# Altium project MP3_Bluetooth_AudioPlayer.PrjPcb
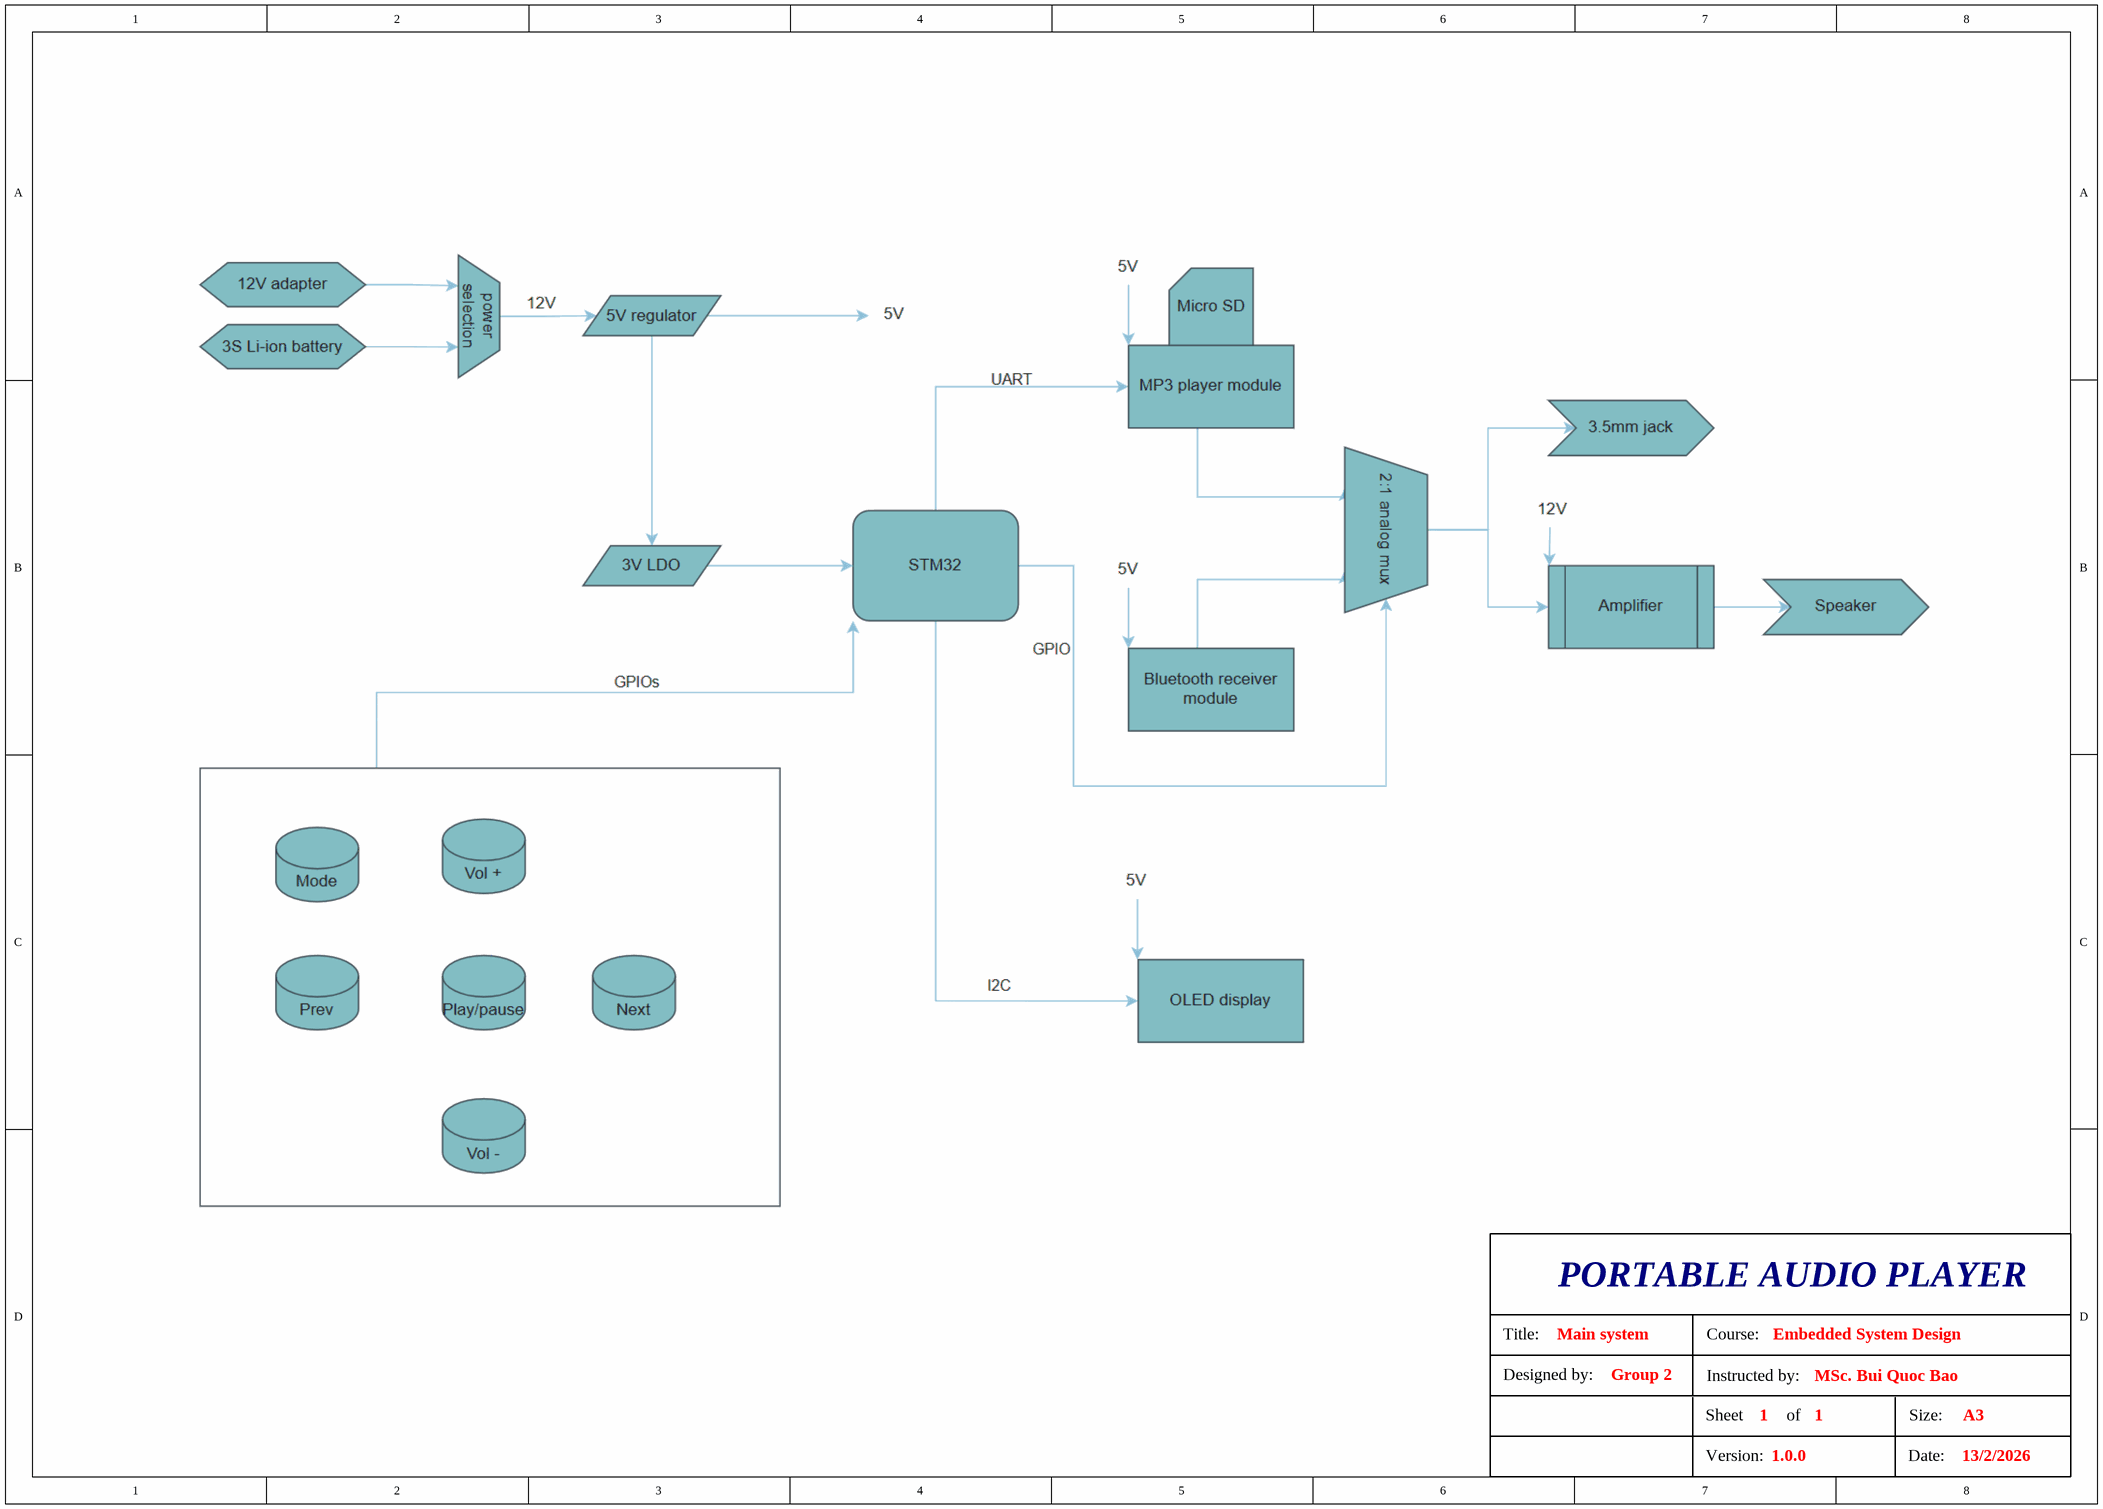
[diagram p0: Sheet3.SchDoc]
3 sheets, 101 parts. Net scope: global (net labels, ports and power ports of the same name join across sheets).
Board file: PCB1.PcbDoc
Sheets:
  Sheet3.SchDoc
  Sheet4.SchDoc
  Sheet1.SchDoc

## Sheet Sheet3.SchDoc
size A3; SheetNumber: 3; SheetTotal: 4

### Notes on the sheet
- PORTABLE AUDIO PLAYER
- Designed by:
- Title:
- Main system
- Group 2
- Instructed by:
- Course:
- Embedded System Design
- MSc. Bui Quoc Bao
- Version:
- Sheet
- 1
- 1.0.0
- of
- Date:
- Size:
- 13/2/2026
- A3

## Sheet Sheet4.SchDoc
size A3; SheetNumber: 4; SheetTotal: 4
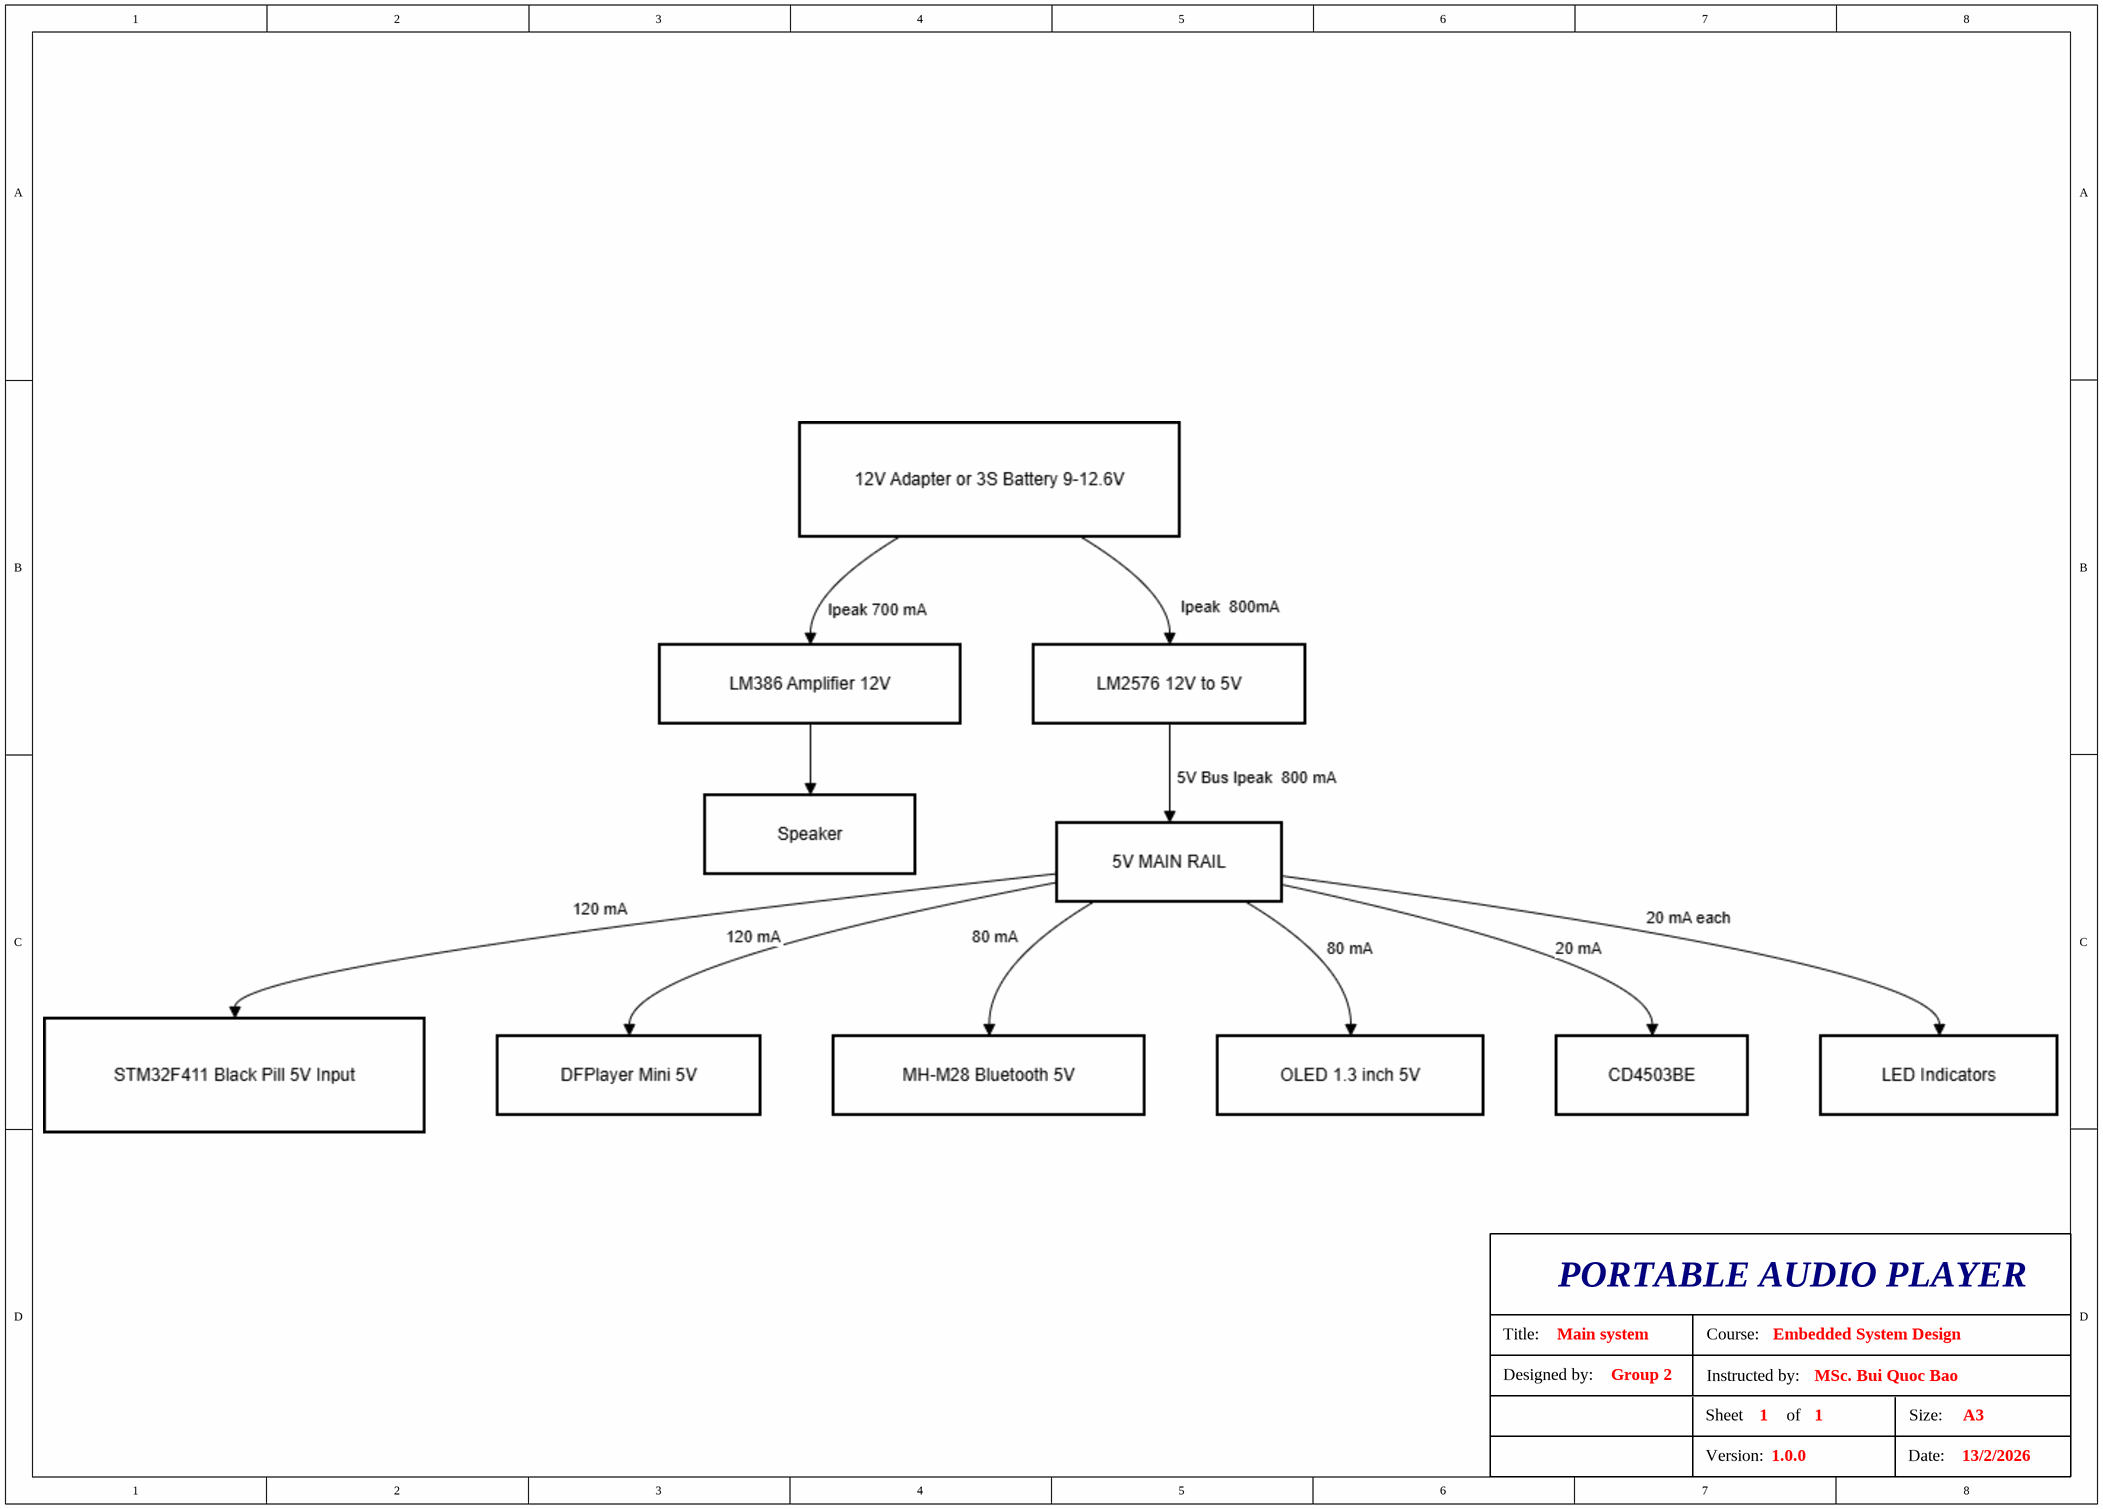
[diagram p1: Sheet4.SchDoc]

### Notes on the sheet
- PORTABLE AUDIO PLAYER
- Designed by:
- Title:
- Main system
- Group 2
- Instructed by:
- Course:
- Embedded System Design
- MSc. Bui Quoc Bao
- Version:
- Sheet
- 1
- 1.0.0
- of
- Date:
- Size:
- 13/2/2026
- A3

## Sheet Sheet1.SchDoc
size A3; SheetNumber: 4; SheetTotal: 4
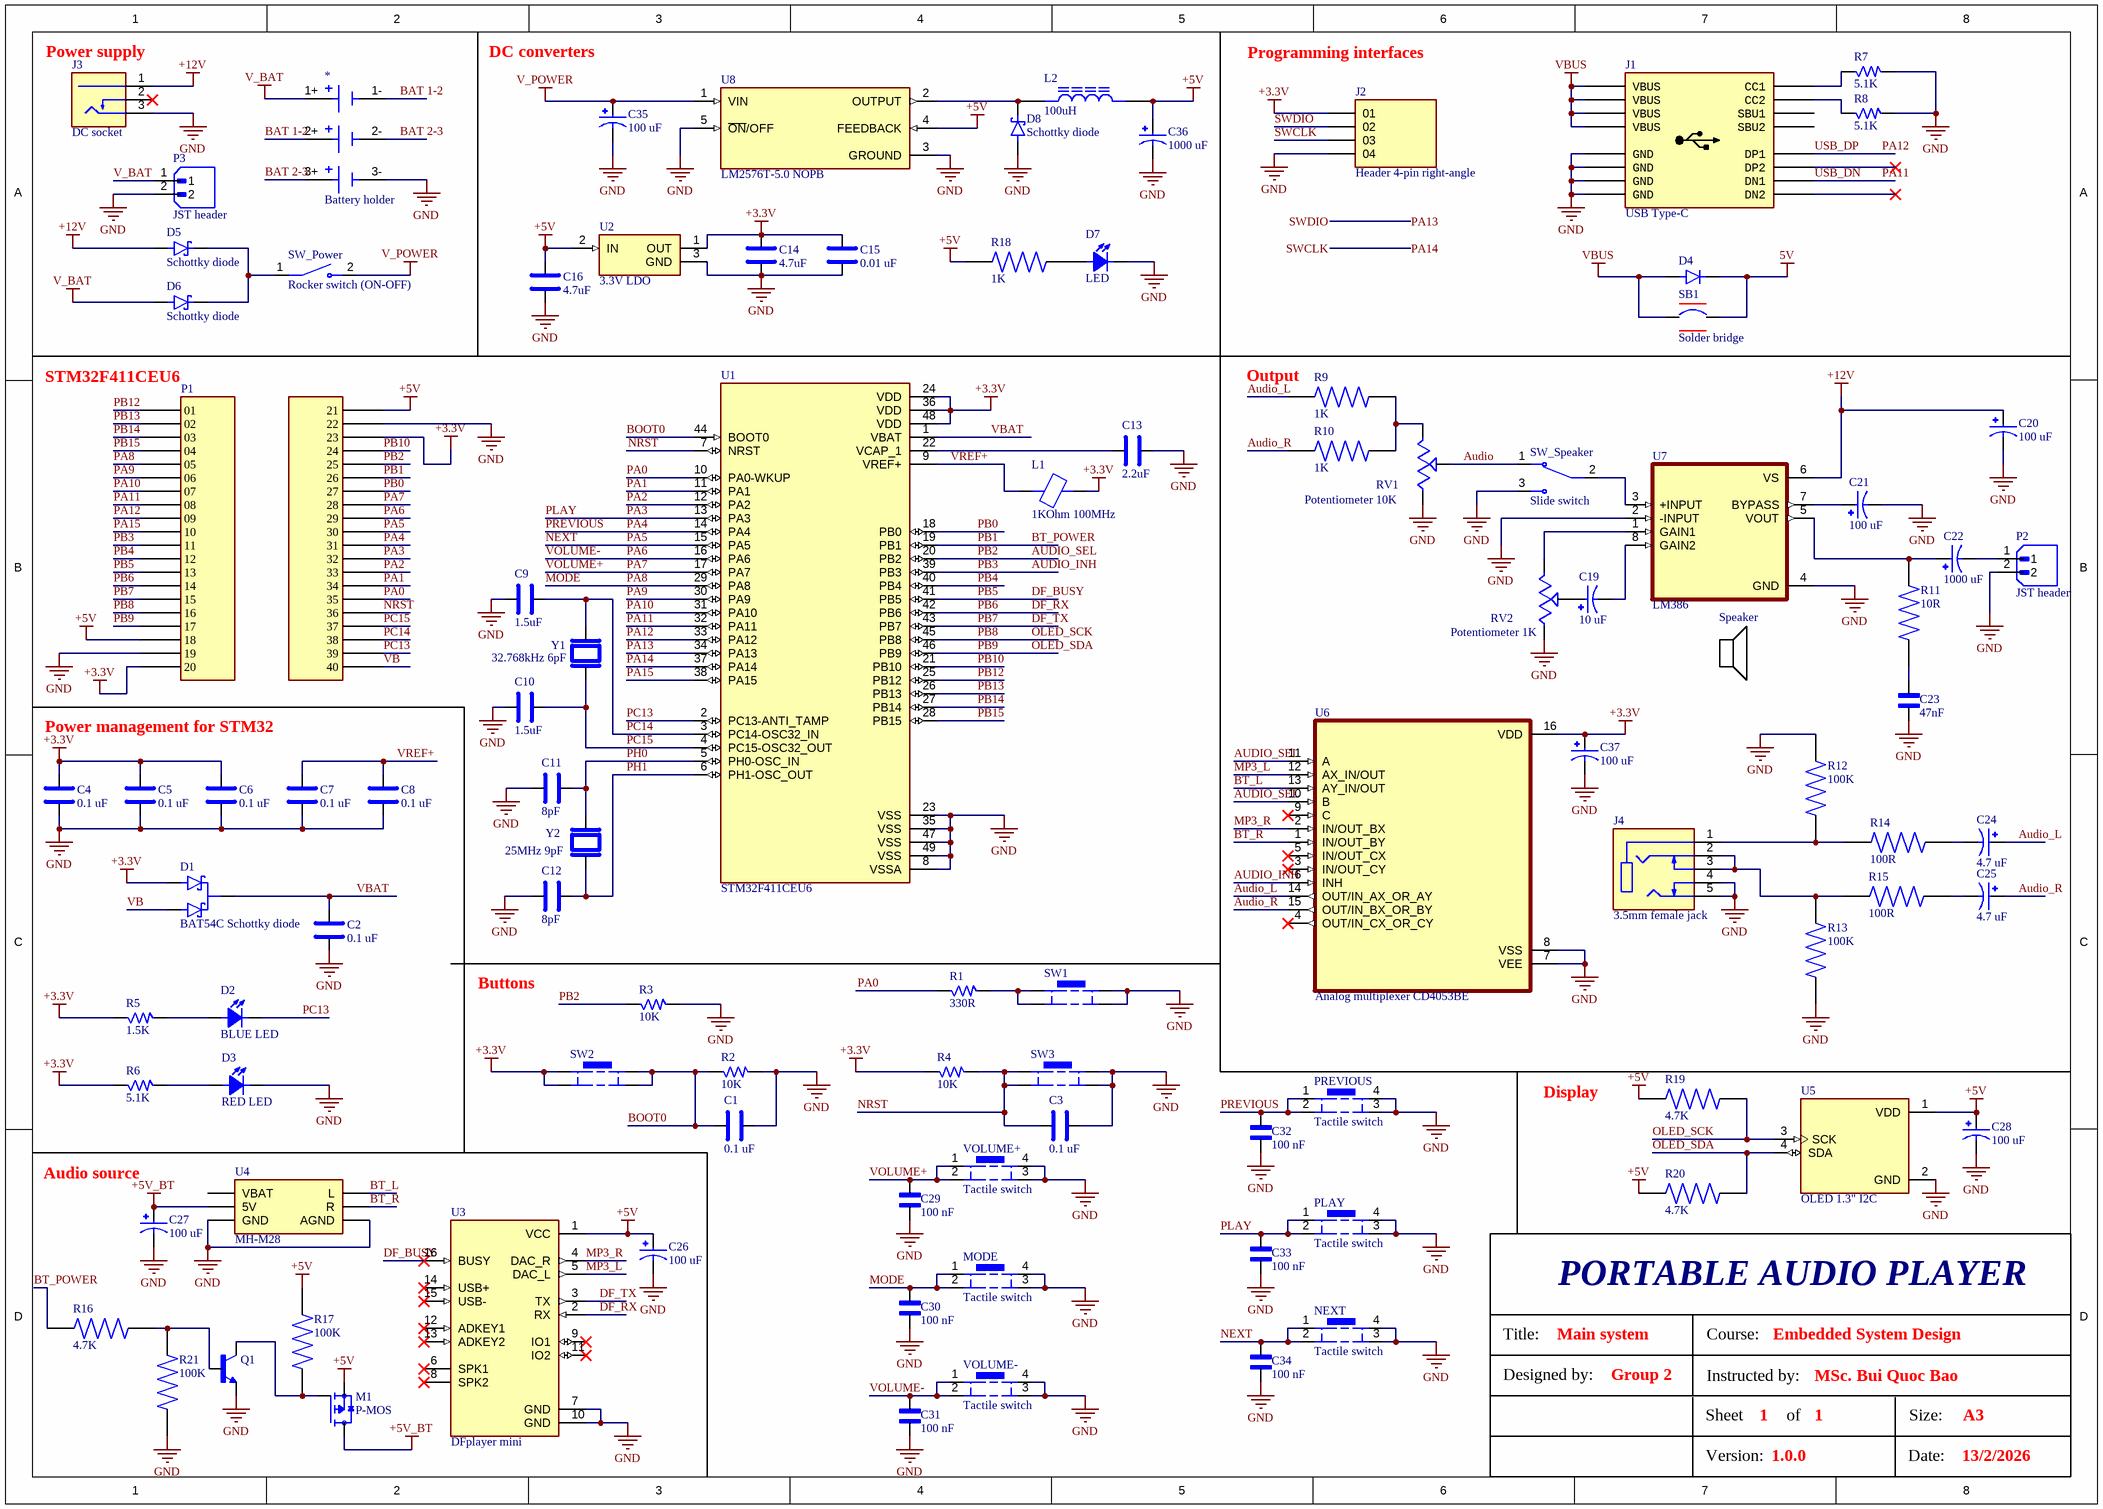
[diagram p2: Sheet1.SchDoc]

### Parts
*  Battery holder  [BAT_BK-18650-PC6]
C1  0.1 uF  [CAP-CER-0603]
C2  0.1 uF  [CAP-CER-0603]
C3  0.1 uF  [CAP-CER-0603]
C4  0.1 uF  [CAP-CER-0603]
C5  0.1 uF  [CAP-CER-0603]
C6  0.1 uF  [CAP-CER-0603]
C7  0.1 uF  [CAP-CER-0603]
C8  0.1 uF  [CAP-CER-0603]
C9  1.5uF  [CAP-CER-0603]
C10  1.5uF  [CAP-CER-0603]
C11  8pF  [CAP-CER-0603]
C12  8pF  [CAP-CER-0603]
C13  2.2uF  [CAP-CER-0603]
C14  4.7uF  [CAP-CER-0603]
C15  0.01 uF  [CAP-CER-0603]
C16  4.7uF  [CAP-CER-0603]
C19  10 uF  [CAPPRD200W50D500H1100]
C20  100 uF  [CAPPRD250W50D630H1120]
C21  100 uF  [CAPPRD250W50D630H1120]
C22  1000 uF  [CAPPRD500W60D1000H2500]
C23  47nF  [CAPRR254W50L508T317H508]
C24  4.7 uF  [CAPPRD200W50D500H1100]
C25  4.7 uF  [CAPPRD200W50D500H1100]
C26  100 uF  [CAPPRD250W50D630H1120]
C27  100 uF  [CAPPRD250W50D630H1120]
C28  100 uF  [CAPPRD250W50D630H1120]
C29  100 nF  [CAPRR254W54L381T254H466]
C30  100 nF  [CAPRR254W54L381T254H466]
C31  100 nF  [CAPRR254W54L381T254H466]
C32  100 nF  [CAPRR254W54L381T254H466]
C33  100 nF  [CAPRR254W54L381T254H466]
C34  100 nF  [CAPRR254W54L381T254H466]
C35  100 uF  [CAPPRD250W50D630H1120]
C36  1000 uF  [CAPPRD500W60D1000H2500]
C37  100 uF  [CAPPRD250W50D630H1120]
D1  BAT54C Schottky diode  [SOT95P237X112-3N]
D2  BLUE LED  [LED-SMD-0603]
D3  RED LED  [LED-SMD-0603]
D4  Diode  [DIOM5227X270N]  (value not drawn)
D5  Schottky diode  [DIOAD1039W78L463D236]
D6  Schottky diode  [DIOAD1039W78L463D236]
D7  LED  [LED-TH-2.54mm]
D8  Schottky diode  [DIOAD1039W78L463D236]
J1  USB Type-C  [TYPE-C-16POS]
J2  Header 4-pin right-angle  [SAMTEC_HTSW-104-08-G-S-RA]
J3  DC socket  [GRAVITECH_CON-SOCJ-2155]
J4  3.5mm female jack  [CLIFF_FC68133]
L1  1KOhm 100MHz  [FERRITE-0603]
L2  100uH  [IND_RLB9012-101KL]
M1  P-MOS  [TO254P1067X483X2286-3]
MODE  Tactile switch  [Tactice-Switch-TH-12x12]
NEXT  Tactile switch  [Tactice-Switch-TH-12x12]
P1  2x20 female header for mounting Blackpill board  [Blackpill board mounting headers]  (value not drawn)
P2  JST header  [JST_B2B-XH-A]
P3  JST header  [JST_B2B-XH-A]
PLAY  Tactile switch  [Tactice-Switch-TH-12x12]
PREVIOUS  Tactile switch  [Tactice-Switch-TH-12x12]
Q1  NPN transistor  [TO92127P495H495-3]  (value not drawn)
R1  330R  [RES-SMD-0603]
R2  10K  [RES-SMD-0603]
R3  10K  [RES-SMD-0603]
R4  10K  [RES-SMD-0603]
R5  1.5K  [RES-SMD-0603]
R6  5.1K  [RES-SMD-0603]
R7  5.1K  [RES-SMD-0603]
R8  5.1K  [RES-SMD-0603]
R9  1K  [RESAD1100W55L680D260]
R10  1K  [RESAD1100W55L680D260]
R11  10R  [RESAD1100W55L680D260]
R12  100K  [RESAD1100W55L680D260]
R13  100K  [RESAD1100W55L680D260]
R14  100R  [RESAD1100W55L680D260]
R15  100R  [RESAD1100W55L680D260]
R16  4.7K  [RESAD1100W55L680D260]
R17  100K  [RESAD1100W55L680D260]
R18  1K  [RESAD1100W55L680D260]
R19  4.7K  [RESAD1100W55L680D260]
R20  4.7K  [RESAD1100W55L680D260]
R21  100K  [RESAD1100W55L680D260]
RV1  Potentiometer 10K  [TRIM_WH148-1A-2-18T-L20]
RV2  Potentiometer 1K  [TRIM_WH148-1A-2-18T-L20]
SB1  Solder bridge  [SOLDER_BRIDGE]
Speaker  Speaker  [50mm speaker]  (value not drawn)
SW1  SW_small_rectangular  [SW_SKRPACE010]  (value not drawn)
SW2  SW_small_rectangular  [SW_SKRPACE010]  (value not drawn)
SW3  SW_small_rectangular  [SW_SKRPACE010]  (value not drawn)
SW_Power  Rocker switch (ON-OFF)  [Rocker switch (ON-OFF)]
SW_Speaker  Slide switch  [SW_SLW-1276864-4A-D]
U1  STM32F411CEU6  [QFN50P700X700X60-49N]
U2  3.3V LDO  [SOT23-3]
U3  DFplayer mini  [MODULE_DFR0299]
U4  MH-M28  [MH-M28]
U5  OLED 1.3" I2C  [LCD_OLED_128X64_1.3_I2C]
U6  Analog multiplexer CD4053BE  [DIP_16]
U7  LM386  [DIP_8]
U8  LM2576T-5.0 NOPB  [TO170P1067X483X1651-5]
VOLUME+  Tactile switch  [Tactice-Switch-TH-12x12]
VOLUME-  Tactile switch  [Tactice-Switch-TH-12x12]
Y1  32.768kHz 6pF  [XTAL_CM8V-T1A-32.768KHZ-6PF-20PPM-TA-QC]
Y2  25MHz 9pF  [XTAL_SXT2249BB16-25.000MT]

### Nets
5V: D4.C(K) SB1.2
+3.3V: C4.2 C5.2 C6.2 C14.2 C15.2 C37.P D1.1 J2.01 L1.2 P1.20 P1.23 R4.1 R5.1 R6.1 SW2.1 SW2.2 U1.24(VDD) U1.36(VDD) U1.48(VDD) U2.1(OUT) U6.16(VDD)
+5V: C16.2 C26.P C28.P C36.P L2.2 M1.3(S) P1.18 P1.21 R17.2 R18.1 R19.2 R20.1 U2.2(IN) U3.1(VCC) U5.1(VDD) U8.4(FEEDBACK)
+5V_BT: C27.P M1.2(D) U4.5V
+12V: C20.P D5.2(A) J3.1 U7.6(VS)
GND: *.3- C1.2 C2.1 C3.2 C4.1 C5.1 C6.1 C7.1 C8.1 C9.1 C10.1 C11.1 C12.1 C13.2 C14.1 C15.1 C16.1 C20.N C21.N C23.1 C26.N C27.N C28.N C29.1 C30.1 C31.1 C32.1 C33.1 C34.1 C35.N C36.N C37.N D3.2(K) D7.2(K) D8.2(A) J1.A1_B12(GND) J1.A12_B1(GND) J2.04 J3.3 J4.4 J4.5 MODE.3 MODE.4 NEXT.3 NEXT.4 P1.19 P1.22 P2.2 P3.2 PLAY.3 PLAY.4 PREVIOUS.3 PREVIOUS.4 Q1.1(E) R2.2 R3.2 R7.2 R8.2 R12.2 R13.2 R21.1 RV1.3 RV2.3 SW1.3 SW1.4 SW3.3 SW3.4 SW_Speaker.3 U1.8(VSSA) U1.23(VSS) U1.35(VSS) U1.47(VSS) U1.49(VSS) U2.3(GND) U3.7(GND) U3.10(GND) U4.AGND U4.GND U5.2(GND) U6.7(VEE) U6.8(VSS) U7.2(-INPUT) U7.4(GND) U8.3(GROUND) U8.5(~{ON}/OFF) VOLUME+.3 VOLUME+.4 VOLUME-.3 VOLUME-.4
V_BAT: *.1+ D6.2(A) P3.1
V_POWER: C35.P SW_Power.2 U8.1(VIN)
VBUS: D4.A J1.A4_B9(VBUS) J1.A9_B4(VBUS) SB1.1
Audio: RV1.2 SW_Speaker.1
AUDIO_INH: P1.11 U1.39(PB3) U6.6(INH)  [also labelled PB3]
Audio_L: C24.P R9.1 U6.14(OUT/IN_AX_OR_AY)
Audio_R: C25.P R10.1 U6.15(OUT/IN_BX_OR_BY)
AUDIO_SEL: P1.25 R3.1 U1.20(PB2) U6.10(B) U6.11(A)  [also labelled PB2]
BAT 1-2: *.1- *.2+
BAT 2-3: *.2- *.3+
BOOT0: C1.1 R2.1 SW2.3 SW2.4 U1.44(BOOT0)
BT_L: U4.L U6.13(AY_IN/OUT)
BT_POWER: P1.26 R16.1 U1.19(PB1)  [also labelled PB1]
BT_R: U4.R U6.1(IN/OUT_BY)
DF_BUSY: P1.13 U1.41(PB5) U3.16(BUSY)  [also labelled PB5]
DF_RX: P1.14 U1.42(PB6) U3.2(RX)  [also labelled PB6]
DF_TX: P1.15 U1.43(PB7) U3.3(TX)  [also labelled PB7]
MODE: C30.2 MODE.1 MODE.2 P1.5(05) U1.29(PA8)  [also labelled PA8]
MP3_L: U3.5(DAC_L) U6.12(AX_IN/OUT)
MP3_R: U3.4(DAC_R) U6.2(IN/OUT_BX)
NEXT: C34.2 NEXT.1 NEXT.2 P1.30 U1.15(PA5)  [also labelled PA5]
NRST: C3.1 P1.36 R4.2 SW3.1 SW3.2 U1.7(NRST)
OLED_SCK: P1.16 R19.1 U1.45(PB8) U5.3(SCK)  [also labelled PB8]
OLED_SDA: P1.17 R20.2 U1.46(PB9) U5.4(SDA)  [also labelled PB9]
PA0: P1.35 R1.1 U1.10(PA0-WKUP)
PA1: P1.34 U1.11(PA1)
PA2: P1.33 U1.12(PA2)
PA3: C33.2 P1.32 PLAY.1 PLAY.2 U1.13(PA3)  [also labelled PLAY]
PA4: C32.2 P1.31 PREVIOUS.1 PREVIOUS.2 U1.14(PA4)  [also labelled PREVIOUS]
PA6: C31.2 P1.29 U1.16(PA6) VOLUME-.1 VOLUME-.2  [also labelled VOLUME-]
PA7: C29.2 P1.28 U1.17(PA7) VOLUME+.1 VOLUME+.2  [also labelled VOLUME+]
PA9: P1.6(06) U1.30(PA9)
PA10: P1.7(07) U1.31(PA10)
PA11: J1.A7(DN1) P1.8(08) U1.32(PA11)  [also labelled USB_DN]
PA12: J1.A6(DP1) P1.9(09) U1.33(PA12)  [also labelled USB_DP]
PA13: J2.02 U1.34(PA13)  [also labelled SWDIO]
PA14: J2.03 U1.37(PA14)  [also labelled SWCLK]
PA15: P1.10 U1.38(PA15)
PB0: P1.27 U1.18(PB0)
PB4: P1.12 U1.40(PB4)
PB10: P1.24 U1.21(PB10)
PB12: P1.1(01) U1.25(PB12)
PB13: P1.2(02) U1.26(PB13)
PB14: P1.3(03) U1.27(PB14)
PB15: P1.4(04) U1.28(PB15)
PC13: D2.2(K) P1.39 U1.2(PC13-ANTI_TAMP)
PC14: C9.2 P1.38 U1.3(PC14-OSC32_IN) Y1.2
PC15: C10.2 P1.37 U1.4(PC15-OSC32_OUT) Y1.1
PH0: C11.2 U1.5(PH0-OSC_IN) Y2.3
PH1: C12.2 U1.6(PH1-OSC_OUT) Y2.1
VB: D1.2 P1.40
VBAT: C2.2 D1.3 U1.1(VBAT)
VREF+: C7.2 C8.2 L1.1 U1.9(VREF+)
NetC13_1: C13.1 U1.22(VCAP_1)
NetC19_N: C19.N U7.8(GAIN2)
NetC19_P: C19.P RV2.2
NetC21_P: C21.P U7.7(BYPASS)
NetC22_N: C22.N P2.1
NetC22_P: C22.P R11.1 U7.5(VOUT)
NetC23_2: C23.2 R11.2
NetC24_N: C24.N R14.2
NetC25_N: C25.N R15.2
NetD2_1: D2.1(A) R5.2
NetD3_1: D3.1(A) R6.2
NetD5_1: D5.1(K) D6.1(K) SW_Power.1
NetD7_1: D7.1(A) R18.2
NetD8_1: D8.1(K) L2.1 U8.2(OUTPUT)
NetJ1_A5: J1.A5(CC1) R7.1
NetJ1_B5: J1.B5(CC2) R8.1
NetJ4_1: J4.1 R12.1 R14.1
NetJ4_2: J4.2 J4.3 R13.1 R15.1
NetM1_1: M1.1(G) Q1.3(C) R17.1
NetQ1_2: Q1.2(B) R16.2 R21.2
NetR1_2: R1.2 SW1.1 SW1.2
NetR9_2: R9.2 R10.2 RV1.1
NetRV2_1: RV2.1 U7.1(GAIN1)
NetSW_Speaker_2: SW_Speaker.2 U7.3(+INPUT)

Not connected (* = marked no-connect by the designer): J1 A8(SBU1) B6(DP2)* B7(DN2)* B8(SBU2); J3 2*; U3 6(SPK1)* 8(SPK2)* 9(IO1)* 11(IO2)* 12(ADKEY1)* 13(ADKEY2)* 14(USB+)* 15(USB-)*; U4 VBAT; U6 3(IN/OUT_CY)* 4(OUT/IN_CX_OR_CY)* 5(IN/OUT_CX)* 9(C)*

### Notes on the sheet
- (near J3) Power supply
- DC converters
- (near J2) Programming interfaces
- (near P1) STM32F411CEU6
- (near R9) Output
- Power management for STM32
- Buttons
- Display
- (near C27) Audio source
- PORTABLE AUDIO PLAYER
- Designed by:
- Title:
- Main system
- Group 2
- Instructed by:
- Course:
- Embedded System Design
- MSc. Bui Quoc Bao
- Version:
- Sheet
- 1
- 1.0.0
- of
- Date:
- Size:
- 13/2/2026
- A3
- DWG NO:
- REV:
- THIS DOCUMENT AND THE DATA DISCLOSED HEREIN OR
- HEREWITH IS THE PROPERTY OF ALTIUM LIMITED AND MAY
- BE FREELY DISTRIBUTED IN WHOLE. NO RIGHTS ARE
- RESERVED OR EXPRESS OR IMPLIED WARANTEE GIVEN.
- REVISION
- DESCRIPTION
- DATE
- APPROVED
- ENG:
- APPROVALS
- PROJECT
- DSN:
- CHK:
- REFERENCE DOCUMENTS
- PROJECT REVISION:
- TITLE
- DOCUMENT REVISION:
- DESIGN ITEM:
- BOM:
- FAB DWG:
- PCB DWG:
- ASSY DWG:
- SCALE:
- A2
- SIZE
- CAGE CODE
- FILE NAME
- DWG NO.
- SHEET
- OF
- REV